# Altium schematic sheet vesc 6 mk 5.SchDoc
size A; SheetNumber: 1; SheetTotal: 1
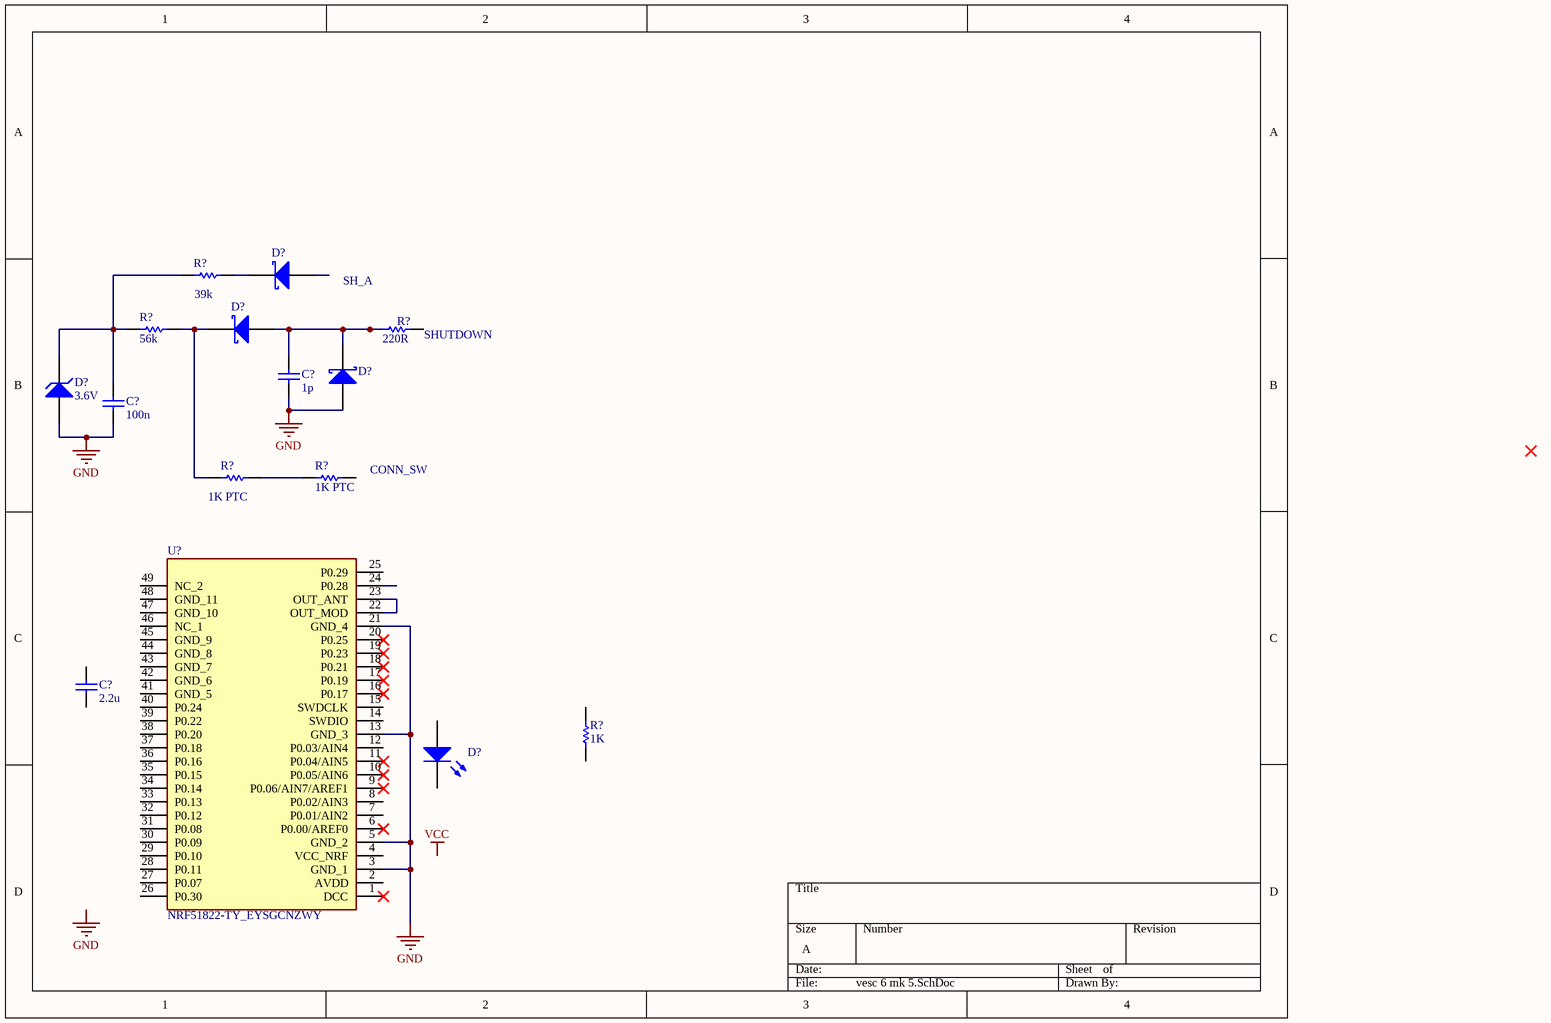
[diagram p0: vesc 6 mk 5.SchDoc]

## Parts
(Parts that share a designator on the sheet are numbered #1, #2 ... from top to bottom, then left to right.)
C?#1  value 1p  (hidden comment: Capacitor)
C?#2  value 100n  (hidden comment: Capacitor)
C?#3  value 2.2u  (hidden comment: Capacitor)
D?#1  Schottky Diode  (value not drawn)
D?#2  Schottky Diode  (value not drawn)
D?#3  Schottky Diode  (value not drawn)
D?#4  BV: 3.6V  (hidden comment: Zener Diode)
D?#5  Light-Emitting Diode  (value not drawn)
R?#1  value 39k  (hidden comment: Resistor)
R?#2  value 56k  (hidden comment: Resistor)
R?#3  value 220R  (hidden comment: Resistor)
R?#4  value 1K PTC  (hidden comment: Resistor)
R?#5  value 1K PTC  (hidden comment: Resistor)
R?#6  value 1K  (hidden comment: Resistor)
U?  NRF51822-TY_EYSGCNZWY  [EYSHCNZXZ]

## Nets
GND: C?#1.1 C?#2.1 D?#3.1(A) D?#4.1(A) U?.3(GND_1) U?.5(GND_2) U?.13(GND_3) U?.21(GND_4)
NetC?#1_2: C?#1.2 D?#2.1(A) D?#3.2(K) R?#3.1
NetC?#2_2: C?#2.2 D?#4.2(K) R?#1.1 R?#2.1
NetD?#1_2: D?#1.2(K) R?#1.2
NetD?#2_2: D?#2.2(K) R?#2.2 R?#4.1
NetR?#4_2: R?#4.2 R?#5.1
NetU?_22: U?.22(OUT_MOD) U?.23(OUT_ANT)

Not connected (* = marked no-connect by the designer): C?#3 1 2; D?#1 1(A); D?#5 1(A) 2(K); R?#3 2; R?#5 2; R?#6 1 2; U? 1(DCC)* 2(AVDD) 4(VCC_NRF) 6(P0.00/AREF0)* 7(P0.01/AIN2) 8(P0.02/AIN3) 9(P0.06/AIN7/AREF1)* 10(P0.05/AIN6)* 11(P0.04/AIN5)* 12(P0.03/AIN4) 14(SWDIO) 15(SWDCLK) 16(P0.17)* 17(P0.19)* 18(P0.21)* 19(P0.23)* 20(P0.25)* 24(P0.28) 25(P0.29) 26(P0.30) 27(P0.07) 28(P0.11) 29(P0.10) 30(P0.09) 31(P0.08) 32(P0.12) 33(P0.13) 34(P0.14) 35(P0.15) 36(P0.16) 37(P0.18) 38(P0.20) 39(P0.22) 40(P0.24) 41(GND_5) 42(GND_6) 43(GND_7) 44(GND_8) 45(GND_9) 46(NC_1) 47(GND_10) 48(GND_11) 49(NC_2)

## Notes on the sheet
- SH_A
- (near R?#3) SHUTDOWN
- (near R?#5) CONN_SW
- Labels drawn without touching a wire or pin: GND, VCC

## Library data of the parts
C?#1-C?#3 = Capacitor: SimulationGenericComponent: True
D?#1-D?#3 = Schottky Diode: AF: 1; BV: 0; BV_MAX: 1e99; EG: 1.11; FC: 0.5; IBV: 0.001; IS: 1e-14; MJSW: 0.33; NTUN: 30; TNOM: 27; XTI: 3; SimulationGenericComponent: True; CJO: 0; CJP: 0; CTA: 0; CTP: 0; FCS: 0.5; FV_MAX: 1e99; IKF: 0; IKR: 0; ISR: 1e-14; JSW: 0; JTUN: 0; JTUNSW: 0; KEG: 1; KF: 0; LEVEL: 1; N: 1; NBV: 1; NR: 1; NS: 1; PHP: 1; RS: 0; TCV: 0; TLEV: 0; TLEVC: 0; TM1: 0; TM2: 0; TPB: 0; TPHP: 0; TRS: 0; TRS2: 0; TT: 0; TTT1: 0; TTT2: 0; VJ: 1; XTITUN: 3
D?#4 = Zener Diode: AF: 1; BV_MAX: 1e99; CJO: 0; EG: 1.11; FC: 0.5; IBV: 0.001; IS: 1e-14; MJSW: 0.33; NTUN: 30; TNOM: 27; XTI: 3; SimulationGenericComponent: True; CJP: 0; CTA: 0; CTP: 0; FCS: 0.5; FV_MAX: 1e99; IKF: 0; IKR: 0; ISR: 1e-14; JSW: 0; JTUN: 0; JTUNSW: 0; KEG: 1; KF: 0; LEVEL: 1; N: 1; NBV: 1; NR: 1; NS: 1; PHP: 1; RS: 0; TCV: 0; TLEV: 0; TLEVC: 0; TM1: 0; TM2: 0; TPB: 0; TPHP: 0; TRS: 0; TRS2: 0; TT: 0; TTT1: 0; TTT2: 0; VJ: 1; XTITUN: 3
D?#5 = LED: AF: 1; BV: 0; BV_MAX: 1e99; EG: 1.11; FC: 0.5; IBV: 0.001; IS: 1e-14; MJSW: 0.33; NTUN: 30; TNOM: 27; XTI: 3; SimulationGenericComponent: True; CJO: 0; CJP: 0; CTA: 0; CTP: 0; FCS: 0.5; FV_MAX: 1e99; IKF: 0; IKR: 0; ISR: 1e-14; JSW: 0; JTUN: 0; JTUNSW: 0; KEG: 1; KF: 0; LEVEL: 1; N: 1; NBV: 1; NR: 1; NS: 1; PHP: 1; RS: 0; TCV: 0; TLEV: 0; TLEVC: 0; TM1: 0; TM2: 0; TPB: 0; TPHP: 0; TRS: 0; TRS2: 0; TT: 0; TTT1: 0; TTT2: 0; VJ: 1; XTITUN: 3
R?#1-R?#6 = Resistor: TC1: 0; SimulationGenericComponent: True; TC2: 0
U? = EYSGCNZWY: Undefined or Miscellaneous; Manufacturer_Name: TAIYO YUDEN; Datasheet Link: https://www.yuden.co.jp/wireless_module/document/datareport2/en/TY_BLE_EYSGCNZ_DataReport_V1.00_20150914E.pdf; Manufacturer_Part_Number: EYSGCNZWY; Mouser Part Number: 963-EYSGCNZWY; Mouser Price/Stock: https://www.mouser.co.uk/ProductDetail/Taiyo-Yuden/EYSGCNZWY?qs=5LuraimkrXlLS9oaHePpcw%3D%3D; Arrow Part Number: EYSGCNZWY; Arrow Price/Stock: https://www.arrow.com/en/products/eysgcnzwy/taiyo-yuden